# EAGLE design RX_slim (EAGLE 9.1.3)
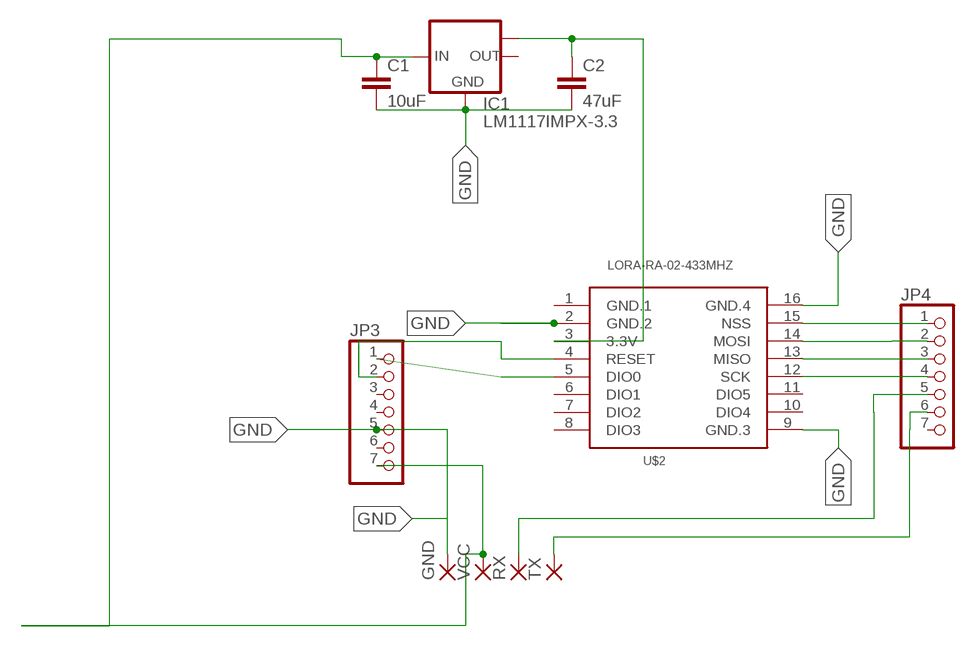
[diagram p0: schematic, sheet 1]

## Parts
C1  10uF  0.33UF/330NF-0805-50V-10%  [0805]
C2  47uF  0.33UF/330NF-0805-50V-10%  [0805]
GND  SMD2  [SMD1,27-2,54]
IC1  LM1117IMPX-3.3  [SOT223]
JP3  PINHD-1X7  [1X07]
JP4  PINHD-1X7  [1X07]
RX  SMD2  [SMD1,27-2,54]
TX  SMD2  [SMD1,27-2,54]
U$2  LORA-RA-02-433MHZ  [LORA-RA2-SMD]
VCC  SMD2  [SMD1,27-2,54]

## Nets
GND: C1.2 C2.2 GND.1(P) IC1.1(GND) JP3.5 U$2.2(GND.2) U$2.9(GND.3) U$2.16(GND.4)
N$1: JP3.1 U$2.5(DIO0)
N$2: JP4.1 U$2.15(NSS)
N$3: JP4.2 U$2.14(MOSI)
N$4: JP4.3 U$2.13(MISO)
N$5: JP4.4 U$2.12(SCK)
N$6: JP3.2 U$2.4(RESET)
N$8: C1.1 IC1.3(IN) JP3.7 VCC.1(P)
N$9: JP4.6 TX.1(P)
N$10: JP4.5 RX.1(P)
N$12: C2.1 IC1.TAB(OUT1) U$2.3(3.3V)
Unconnected: IC1.2(OUT) JP3.3 JP3.4 JP3.6 JP4.7 U$2.6(DIO1) U$2.7(DIO2) U$2.8(DIO3) U$2.10(DIO4) U$2.11(DIO5)

## Power pins joined to a net without a drawn wire
GND.1: U$2.1(GND.1)

## Library data of the parts
C1 C2 = SparkFun-Capacitors:0.33UF/330NF: 0.33µF/330nF ceramic capacitors A capacitor is a passive two-terminal electrical component used to store electrical energy temporarily in an electric field.; PROD_ID: CAP-08469; VALUE: 0.33µF
GND RX TX VCC = wirepad:SMD2: SMD PAD
IC1 = lm1117:LM1117IMPX-*
JP3 JP4 = pinhead:PINHD-1X7: PIN HEADER
U$2 = LikeCircuit:LORA-RA-02-433MHZ: 433 MHz Lora Ra-02 Radio Transceiver Module based on SX1276 chip. Visit our more eagle PCB <https://www.likecircuit.com/>; SPICEPREFIX: X

## Board
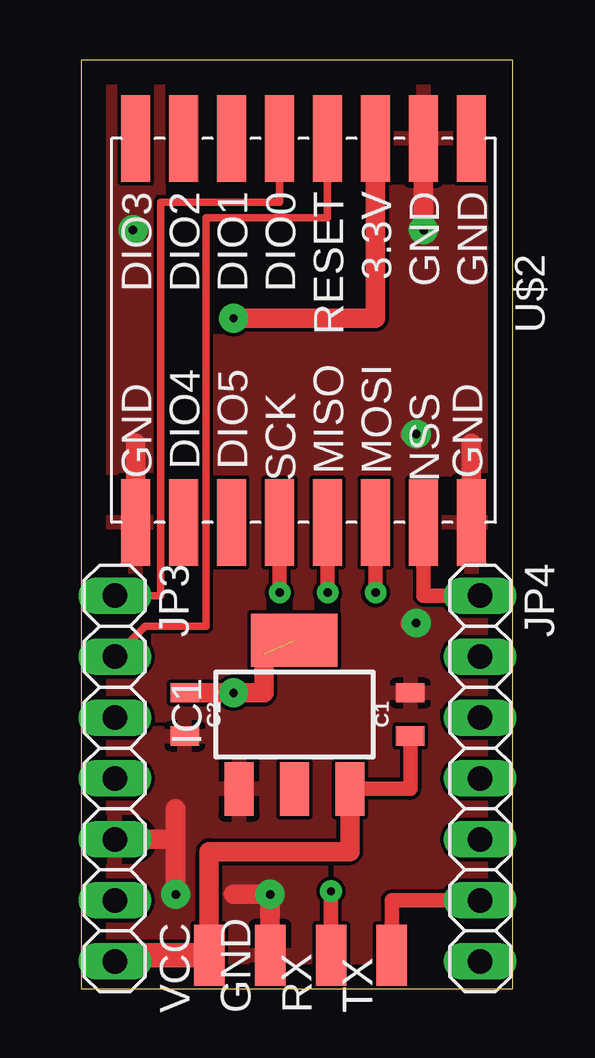
[diagram p1: board, top side]
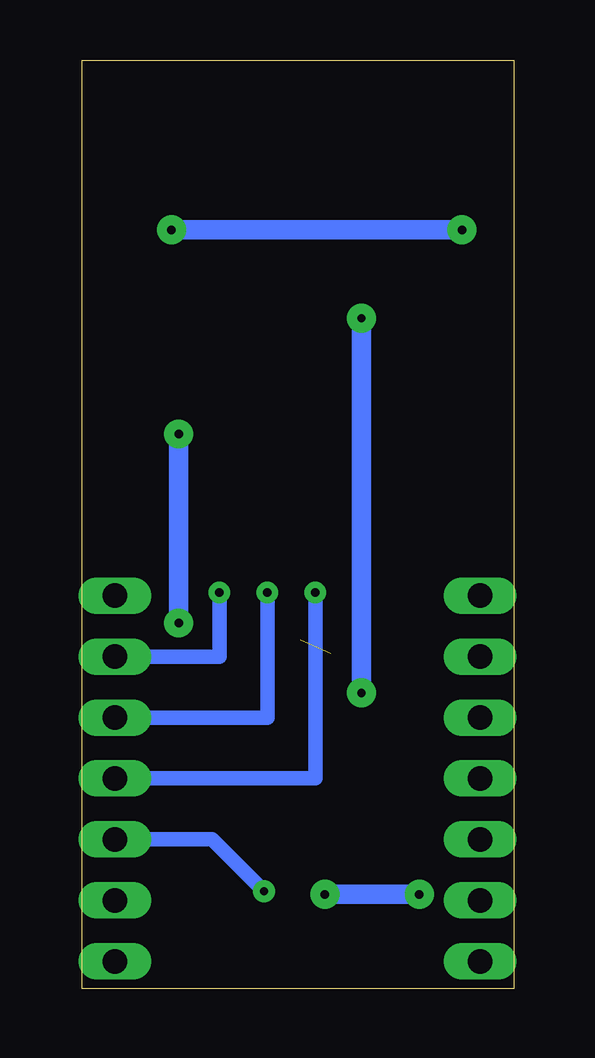
[diagram p2: board, bottom side, seen from below]

Size 18 x 38.7 mm. Coordinates in mm from the lower left corner, seen from the top.
Outline: 0,0 18,0 18,38.7 0,38.7 0,0
Copper layers (1*16): Top 0.035mm / dielectric 1.5mm / Bottom 0.035mm
Design rules "default": minimum track width 6mil, minimum drill 0.35mm, track to track 6mil, track to pad 6mil, pad to pad 6mil, via to via 6mil, smd to smd 6mil, copper to edge 40mil, drill to drill 6mil, minimum pad ring 10mil, minimum via ring 8mil, stop-mask expansion 4mil, vias tented up to drill 0mil, thermal gap 10mil

### Footprints (pad centres in the part's own frame; a part is rotated, then mirrored left to right if it is on the bottom)
0805 = smd 0.8 x 1.2: 1 -0.9,0; 2 0.9,0
SMD1,27-2,54 = smd 1.27 x 2.54: 1 0,0
SOT223 = smd 1.219 x 2.235: 1 -2.311,-3.099; 2 0,-3.099; 3 2.311,-3.099 | smd 3.6 x 2.2: TAB 0,3.099
1X07 = drill 1.016 long: 1 -7.62,0; 2 -5.08,0; 3 -2.54,0; 4 0,0; 5 2.54,0; 6 5.08,0; 7 7.62,0
LORA-RA2-SMD = smd 3.6 x 1.2: 1 -8,7; 2 -8,5; 3 -8,3; 4 -8,1; 5 -8,-1; 6 -8,-3; 7 -8,-5; 8 -8,-7; 9 8,-7; 10 8,-5; 11 8,-3; 12 8,-1; 13 8,1; 14 8,3; 15 8,5; 16 8,7

### Placement (x,y rotation side)
C1  13.72,11.43 90 top
C2  4.32,11.43 270 top
GND  7.87,1.4 0 top
IC1  8.89,11.43 0 top
JP3  1.4,8.76 270 top
JP4  16.64,8.76 270 top
RX  10.41,1.4 0 top
TX  12.95,1.4 0 top
U$2  9.27,27.43 270 top
VCC  5.33,1.4 0 top

### Tracks (layer width: path | path; a pad name or v marks a point on that pad's centre or on a via)
GND  (via drill 0.35 pad 1.2)
  Top 0.813: GND.1 v7.87,3.94 6.35,3.94 | 14.1,35.43 U$2.2 v14.27,31.62 | U$2.16 16.27,22.73 | U$2.9 2.27,22.73 | 3.94,6.22 3.94,7.49 | JP3.5 3.94,6.22 | 3.94,6.22 v3.94,3.94 | v13.97,23.11 13.72,23.11 | 13.72,15.24 v13.97,15.24
  Bottom 0.813: v7.87,3.94 v3.94,3.94 | v14.27,31.62 v2.16,31.62 | v13.97,15.24 v13.97,23.11
  pour Top: 0,38.1 17.78,38.1 20.32,38.1 20.32,-1.27 -6.35,-1.27 -6.35,38.1
N$1
  Top 0.305: U$2.5 8.27,32.77 3.3,32.77 3.3,16.38 JP3.1
N$2
  Top 0.61: U$2.15 14.27,16.38 JP4.1
N$3  (via drill 0.35 pad 0.9)
  Top 0.61: v12.27,16.51 U$2.14
  Bottom 0.61: JP4.2 12.27,13.84 v12.27,16.51
N$4  (via drill 0.35 pad 0.9)
  Top 0.508: 10.29,19.42 U$2.13
  Top 0.61: U$2.13 v10.27,16.51
  Bottom 0.61: JP4.3 10.27,11.3 v10.27,16.51
N$5  (via drill 0.35 pad 0.9)
  Top 0.61: U$2.12 v8.27,16.51
  Bottom 0.61: v8.27,16.51 8.27,8.76 JP4.4
N$6
  Top 0.305: U$2.4 10.27,32.13 5.21,32.13 5.21,15.11 2.67,15.11 JP3.2
N$8
  Top 0.61: C1.1 13.72,8.33 IC1.3
  Top 0.813: VCC.1 5.33,5.71 11.2,5.71 IC1.3
  Top 1.016: VCC.1 1.65,1.4 JP3.7
N$9
  Top 0.61: JP4.6 12.95,3.68 TX.1
N$10  (via drill 0.35 pad 0.9)
  Top 0.61: RX.1 v10.41,4.06
  Bottom 0.61: JP4.5 12.57,6.22 v10.41,4.06
N$12  (via drill 0.35 pad 1.2)  (1 unrouted)
  Top 0.813: C2.1 v6.35,12.33 7.62,12.33 7.62,13.97 | U$2.3 12.27,27.94 v6.35,27.94
  Bottom 0.813: v6.35,27.94 v6.35,12.33
(copper drawn outside any net)
  shapes: Route3 area x393

### Text on the board
INFORMATION: SX12xx | C1 | ASM1117 | C2 | VCC | GND | RX | TX
INFORMATION_BOT: JesusGonfer / 07/10/2018 / RavenLRS | Rev 1
200bmp: C:/Users/Usuario/Desktop/antenna.bmp
209bmp: C:/Users/Usuario/Desktop/antenna.bmp